# EAGLE schematic 526_outin_pico_cardedge (EAGLE 9.6.2)
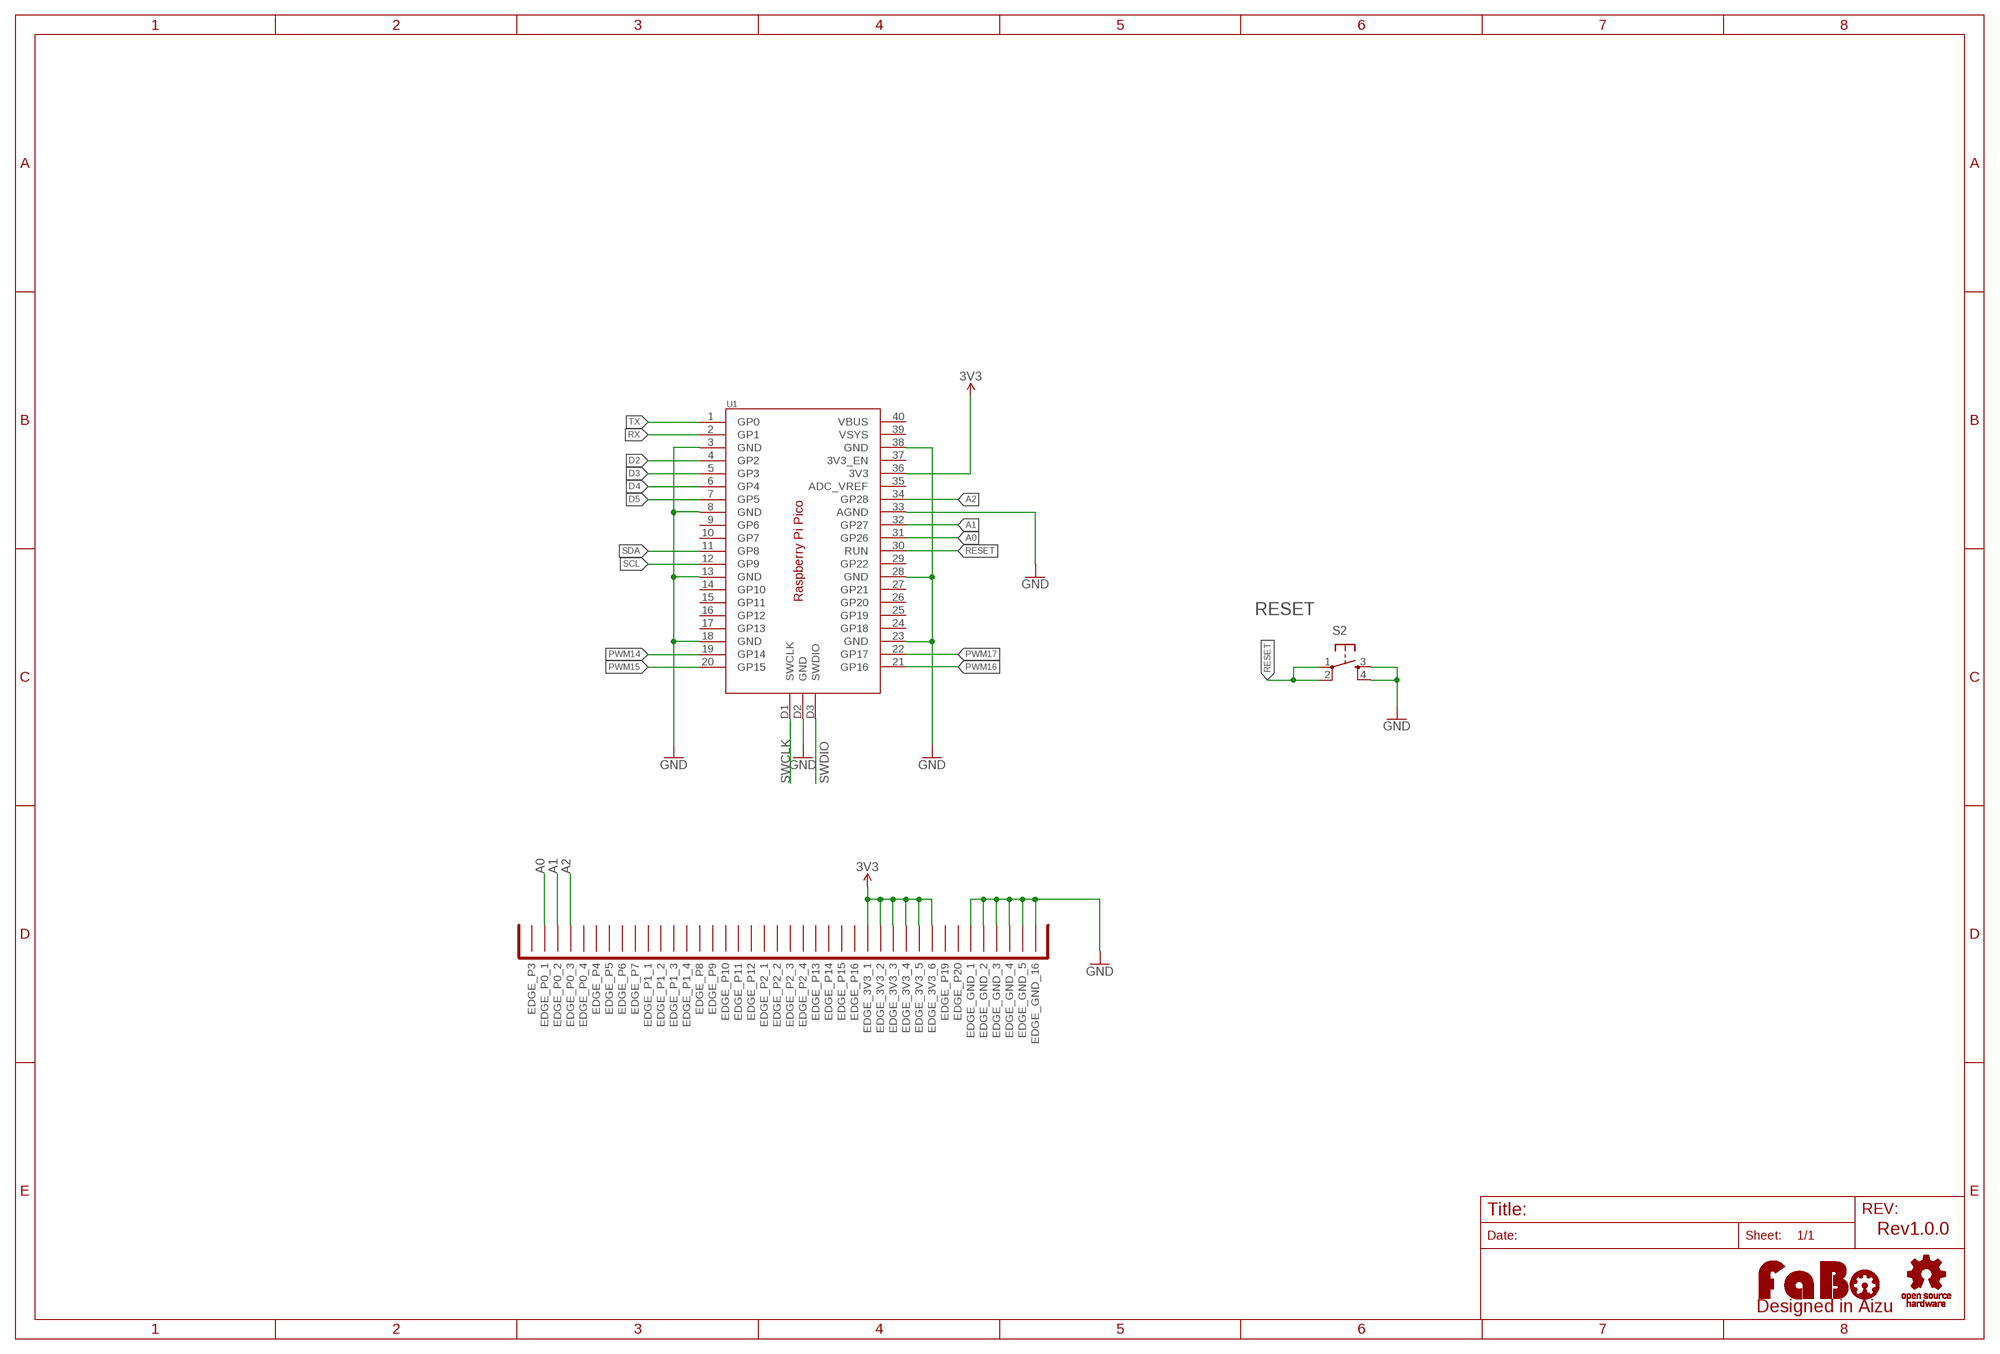
[diagram p0: schematic, sheet 1]

## Parts
LOGO1  LOGO_OSHW-M_BOTTOM  [LOGO_OSHW_M_BOTTOM]
LOGO2  LOGO_FABO-M  [LOGO_FABO_M]
S2  TACT-SWITCH-SMD_KMR2  [KMR2]
U1  RASPBERRY_PI_PICO  [RASPBERRY_PI_PICO_SMD]
U$2  BBC_EDGE  [BBC_EDGE]

## Nets
3V3: U1.36(3V3) U$2.P$27(EDGE_3V3_1) U$2.P$28(EDGE_3V3_2) U$2.P$29(EDGE_3V3_3) U$2.P$30(EDGE_3V3_4) U$2.P$31(EDGE_3V3_5) U$2.P$32(EDGE_3V3_6) U$2.P$67(EDGE_3V3_1) U$2.P$68(EDGE_3V3_2) U$2.P$69(EDGE_3V3_3) U$2.P$70(EDGE_3V3_4) U$2.P$71(EDGE_3V3_5) U$2.P$72(EDGE_3V3_6)
A0: U1.31(GP26) U$2.P$2(EDGE_P0_1) U$2.P$42(EDGE_P0_1)
A1: U1.32(GP27) U$2.P$3(EDGE_P0_2) U$2.P$43(EDGE_P0_2)
A2: U1.34(GP28) U$2.P$4(EDGE_P0_3) U$2.P$44(EDGE_P0_3)
D2: U1.4(GP2)
D3: U1.5(GP3)
D4: U1.6(GP4)
D5: U1.7(GP5)
GND: S2.3 S2.4 U1.3(GND) U1.8(GND) U1.13(GND) U1.18(GND) U1.23(GND) U1.28(GND) U1.33(AGND) U1.38(GND) U1.D2(GND) U$2.P$35(EDGE_GND_1) U$2.P$36(EDGE_GND_2) U$2.P$37(EDGE_GND_3) U$2.P$38(EDGE_GND_4) U$2.P$39(EDGE_GND_5) U$2.P$40(EDGE_GND_16) U$2.P$75(EDGE_GND_1) U$2.P$76(EDGE_GND_2) U$2.P$77(EDGE_GND_3) U$2.P$78(EDGE_GND_4) U$2.P$79(EDGE_GND_5) U$2.P$80(EDGE_GND_16)
PWM14: U1.19(GP14)
PWM15: U1.20(GP15)
PWM16: U1.21(GP16)
PWM17: U1.22(GP17)
RESET: S2.1 S2.2 U1.30(RUN)
RX: U1.2(GP1)
SCL: U1.12(GP9)
SDA: U1.11(GP8)
SWCLK: U1.D1(SWCLK)
SWDIO: U1.D3(SWDIO)
TX: U1.1(GP0)
Unconnected: U1.9(GP6) U1.10(GP7) U1.14(GP10) U1.15(GP11) U1.16(GP12) U1.17(GP13) U1.24(GP18) U1.25(GP19) U1.26(GP20) U1.27(GP21) U1.29(GP22) U1.35(ADC_VREF) U1.37(3V3_EN) U1.39(VSYS) U1.40(VBUS) U$2.P$1(EDGE_P3) U$2.P$5(EDGE_P0_4) U$2.P$6(EDGE_P4) U$2.P$7(EDGE_P5) U$2.P$8(EDGE_P6) U$2.P$9(EDGE_P7) U$2.P$10(EDGE_P1_1) U$2.P$11(EDGE_P1_2) U$2.P$12(EDGE_P1_3) U$2.P$13(EDGE_P1_4) U$2.P$14(EDGE_P8) U$2.P$15(EDGE_P9) U$2.P$16(EDGE_P10) U$2.P$17(EDGE_P11) U$2.P$18(EDGE_P12) U$2.P$19(EDGE_P2_1) U$2.P$20(EDGE_P2_2) U$2.P$21(EDGE_P2_3) U$2.P$22(EDGE_P2_4) U$2.P$23(EDGE_P13) U$2.P$24(EDGE_P14) U$2.P$25(EDGE_P15) U$2.P$26(EDGE_P16) U$2.P$33(EDGE_P19) U$2.P$34(EDGE_P20) U$2.P$41(EDGE_P3) U$2.P$45(EDGE_P0_4) U$2.P$46(EDGE_P4) U$2.P$47(EDGE_P5) U$2.P$48(EDGE_P6) U$2.P$49(EDGE_P7) U$2.P$50(EDGE_P1_1) U$2.P$51(EDGE_P1_2) U$2.P$52(EDGE_P1_3) U$2.P$53(EDGE_P1_4) U$2.P$54(EDGE_P8) U$2.P$55(EDGE_P9) U$2.P$56(EDGE_P10) U$2.P$57(EDGE_P11) U$2.P$58(EDGE_P12) U$2.P$59(EDGE_P2_1) U$2.P$60(EDGE_P2_2) U$2.P$61(EDGE_P2_3) U$2.P$62(EDGE_P2_4) U$2.P$63(EDGE_P13) U$2.P$64(EDGE_P14) U$2.P$65(EDGE_P15) U$2.P$66(EDGE_P16) U$2.P$73(EDGE_P19) U$2.P$74(EDGE_P20)

## Notes on the sheet
- RESET
- Rev1.0.0

## Library data of the parts
LOGO1 = FaBo-Logo:LOGO_OSHW
LOGO2 = FaBo-Logo:LOGO_FABO
S2 = FaBo-Switch:TACT-SWITCH: Part No Maker Datasheet Distributor 1273HA-160G-G SWITRONIC Catalog <http://www.switronic.com/uploads/images/A10.gif> Akizuki <http://akizukidenshi.com/catalog/g/gP-02561/> DTS-6-V Cosland DTS 6 Series <http://www.cosland.com/newproduct/DTS%20SERIES.pdf> Akizuki <http://akizukidenshi.com/catalog/g/gP-03647/> KMR2 C&K KMR2 SERIES <https://www.ckswitches.com/products/switches/product-details/Tactile/KMR2/> Octoparts Result <https://octopart.com/search?q=KMR2&start=0> TSHA-T-XB2-19E TOP UP INDUSTORY TSHA-T <http://www.top-up.com.tw/front/bin/ptdetail.phtml?Part=TSHA-T> Akizuki <http://akizukidenshi.com/catalog/g/gP-09361/>
U1 = FaBo-Boards:RASPBERRY_PI_PICO
U$2 = microbit:BBC_EDGE